# EAGLE schematic nrf51822 (EAGLE 6.4)
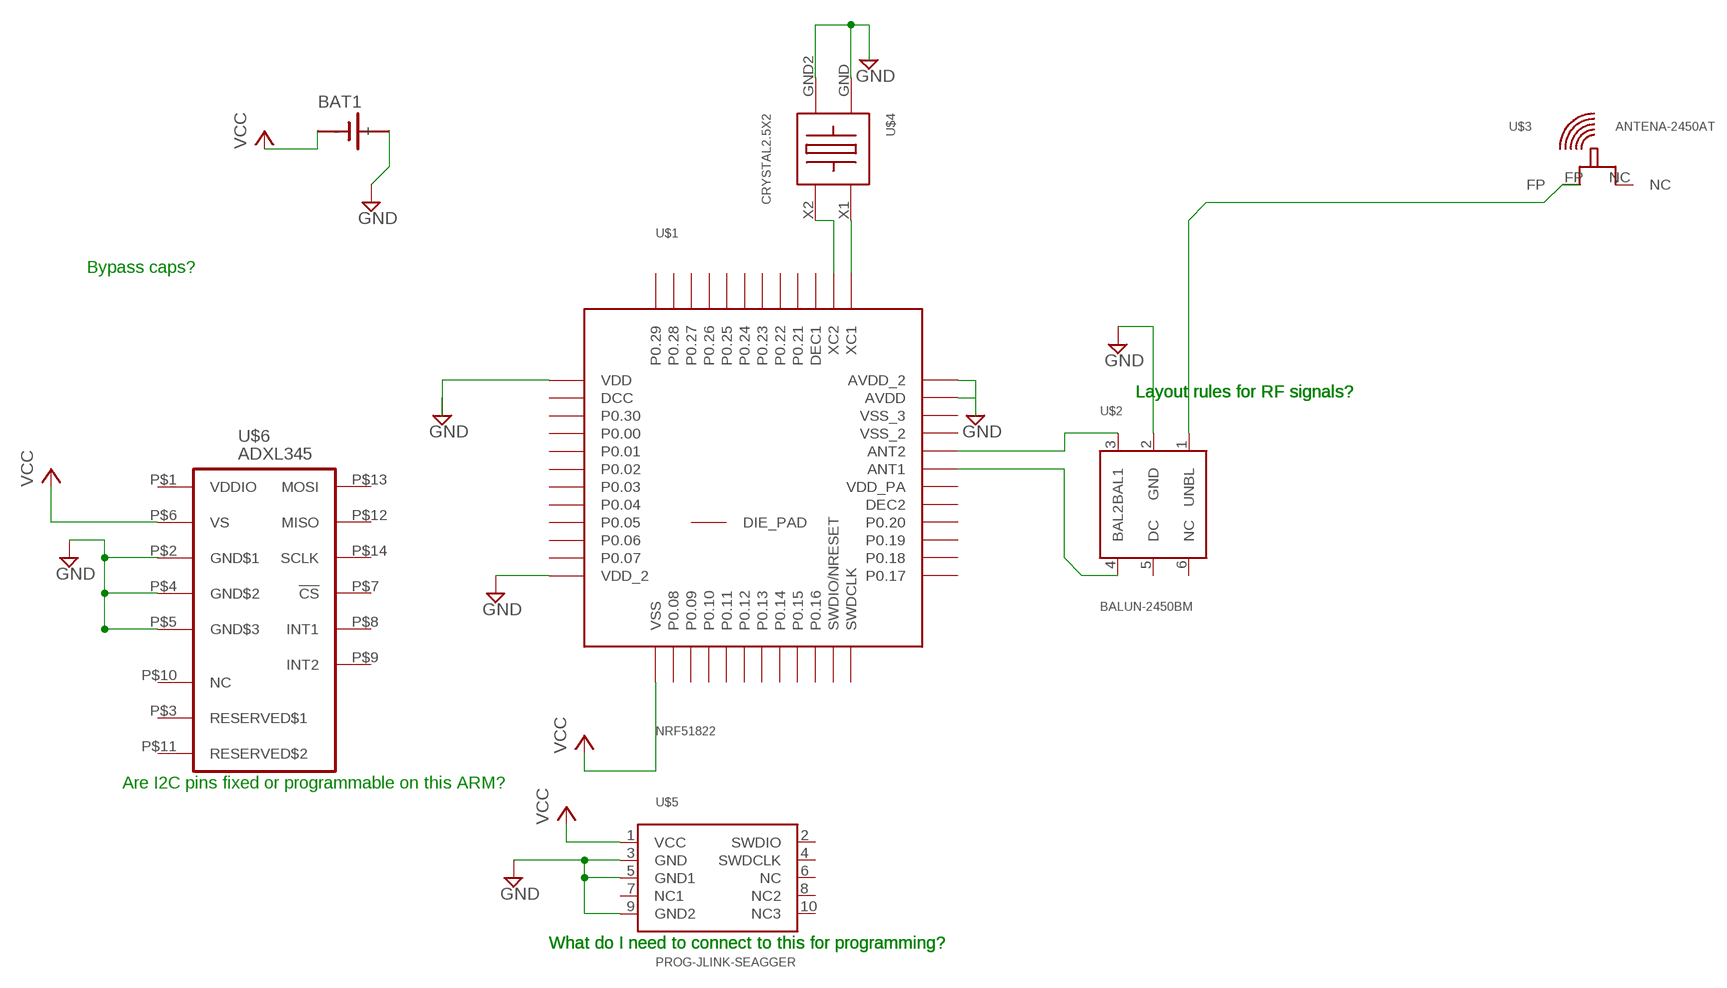
[diagram p0: schematic, sheet 1]

## Parts
BAT1  SN2032  [SN2032]
U$1  NRF51822  [QFN48]
U$2  BALUN-2450BM  [2450BM14A0002]
U$3  ANTENA-2450AT  [2450AT18B100]
U$4  CRYSTAL2.5X2  [2.5X2MM]
U$5  PROG-JLINK-SEAGGER  [M50-3600742]
U$6  ADXL345  [LGA14]

## Nets
GND: BAT1.+ U$1.1(VDD) U$1.12(VDD_2) U$2.2(GND) U$5.3(GND) U$5.5(GND1) U$5.9(GND2) U$6.P$2(GND$1) U$6.P$4(GND$2) U$6.P$5(GND$3)
N$1: U$1.38(XC2) U$4.X2
N$2: U$1.37(XC1) U$4.X1
N$6: U$1.32(ANT2) U$2.3(BAL1)
N$7: U$1.31(ANT1) U$2.4(BAL2)
N$8: U$2.1(UNBL) U$3.FP
N$10: U$1.35(AVDD) U$1.36(AVDD_2)
N$12: U$4.GND U$4.GND2
VCC: BAT1.- U$1.13(VSS) U$5.1(VCC) U$6.P$6(VS)
Unconnected: U$1.2(DCC) U$1.3(P0.30) U$1.4(P0.00) U$1.5(P0.01) U$1.6(P0.02) U$1.7(P0.03) U$1.8(P0.04) U$1.9(P0.05) U$1.10(P0.06) U$1.11(P0.07) U$1.14(P0.08) U$1.15(P0.09) U$1.16(P0.10) U$1.17(P0.11) U$1.18(P0.12) U$1.19(P0.13) U$1.20(P0.14) U$1.21(P0.15) U$1.22(P0.16) U$1.23(SWDIO/NRESET) U$1.24(SWDCLK) U$1.25(P0.17) U$1.26(P0.18) U$1.27(P0.19) U$1.28(P0.20) U$1.29(DEC2) U$1.30(VDD_PA) U$1.33(VSS_2) U$1.34(VSS_3) U$1.39(DEC1) U$1.40(P0.21) U$1.41(P0.22) U$1.42(P0.23) U$1.43(P0.24) U$1.44(P0.25) U$1.45(P0.26) U$1.46(P0.27) U$1.47(P0.28) U$1.48(P0.29) U$1.GND(DIE_PAD) U$2.5(DC) U$2.6(NC) U$3.NC U$5.2(SWDIO) U$5.4(SWDCLK) U$5.6(NC) U$5.7(NC1) U$5.8(NC2) U$5.10(NC3) U$6.P$3(RESERVED$1) U$6.P$7(!CS) U$6.P$8(INT1) U$6.P$9(INT2) U$6.P$10(NC) U$6.P$11(RESERVED$2) U$6.P$12(MISO) U$6.P$13(MOSI) U$6.P$14(SCLK)

## Notes on the sheet
- Bypass caps?
- Layout rules for RF signals? | Layout rules for RF signals? | Layout rules for RF signals?
- Are I2C pins fixed or programmable on this ARM?
- What do I need to connect to this for programming? | What do I need to connect to this for programming? | What do I need to connect to this for programming?

## Power pins joined to a net without a drawn wire
VDDIO: U$6.P$1(VDDIO)

## Library data of the parts
BAT1 = sn2032:SN2032: LI BATTERY
U$1 = NordicSemi:NRF51822: Bluetooth 4.0 Low Energy/2.4Ghz NORDIC SEMICONDUCTOR
U$2 = NordicSemi:BALUN-2450BM: General Specifications: Part Number 2450BM14A0002 Insertion Loss 2.0 dB max. Frequency (MHz) 2400 - 2500 Return Loss 9.5 dB min. Unbalanced Impedance 50 Ω Phase Difference 160° ± 15° Amplitude Difference 3.5 ± 1.5 dB Reel Quanity 4,000 Operating Temperature -40 to +85°C Attenuation: Common Mode 2.45 GHz Impedance Matched Balun-Filter: Optimized for Nordic's Chipset nRF24L01/+ Differential Balanced Impedance Conjugate match to Nordic nRF24L01/nRF24L01+ Attenuation: Differential Mode 15 min.@4800~5000MHz 15 min.@7200~7500MHz
U$3 = NordicSemi:ANTENA-2450AT: General Specifications: Part Number 2450AT18B100 Input Power 3W max. Frequency Range 2400 - 2500 Mhz Impedance 50 Ω Peak Gain 0.5 dBi typ. (XZ-V) Operating Temperature -40 to +85°C Average Gain -0.5 dBi typ. (XZ-V) Reel Quanity 3,000 Return Loss 9.5 dB min
U$4 = NordicSemi:CRYSTAL2.5X2: Crystal 16.00MHz 8pF SMD Size Dimension: 2.5mm x 2.00mm Package: 4-SMD
U$5 = NordicSemi:PROG-JLINK-SEAGGER: 1.27mm Pitch Dil Vertical SMT Pin Header Manufacturer: Harwin Product Number: M50-3601042
U$6 = adxl345:ADXL345: 3-Axis, ±2 g/±4 g/±8 g/±16 g Digital Accelerometer